# EAGLE design carte_balise_v100 (EAGLE 7.3.0)
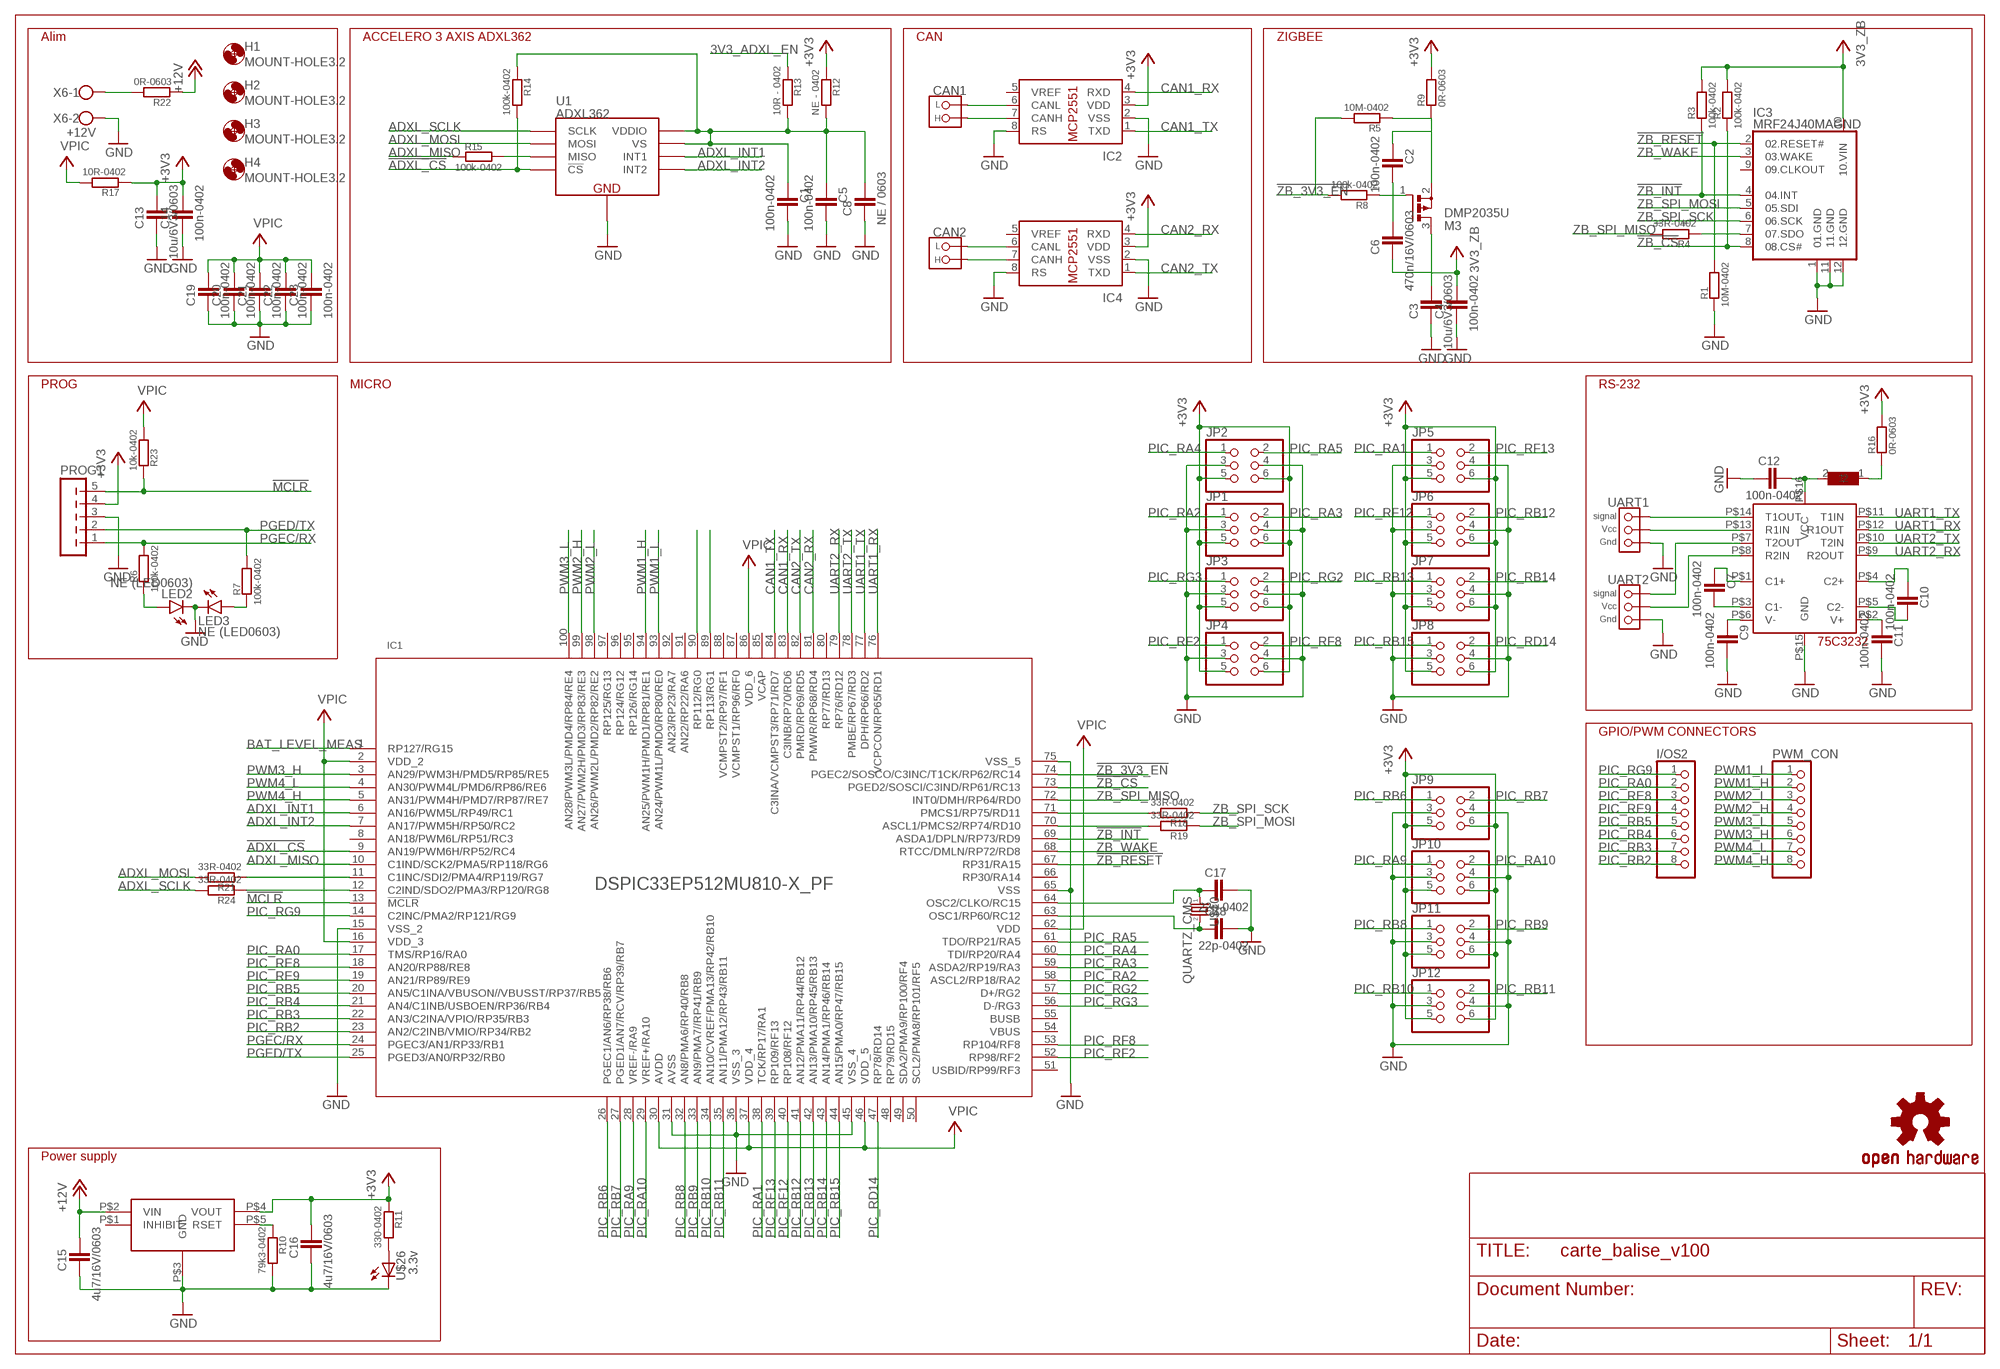
[diagram p0: schematic, sheet 1]

## Parts
C1  100n-0402  C0402K  [0402K]
C2  100n-0402  C0402K  [0402K]
C3  10u/6V3/0603  C0603K  [0603K]
C4  100n-0402  C0402K  [0402K]
C5  100n-0402  C0402K  [0402K]
C6  470n/16V/0603  C0603K  [0603K]
C7  100n-0402  C0402K  [0402K]
C8  NE / 0603  C0603K  [0603K]
C9  100n-0402  C0402K  [0402K]
C10  100n-0402  C0402K  [0402K]
C11  100n-0402  C0402K  [0402K]
C12  100n-0402  C0402K  [0402K]
C13  10u/6V3/0603  C0603K  [0603K]
C14  100n-0402  C0402K  [0402K]
C15  4u7/16V/0603  C0603K  [0603K]
C16  4u7/16V/0603  C0603K  [0603K]
C17  22p-0402  C0402K  [0402K]
C18  22p-0402  C0402K  [0402K]
C19  100n-0402  C0402K  [0402K]
C20  100n-0402  C0402K  [0402K]
C21  100n-0402  C0402K  [0402K]
C22  100n-0402  C0402K  [0402K]
C23  100n-0402  C0402K  [0402K]
CAN1  CONNECT_CAN  [CONNECT_CAN]
CAN2  CONNECT_CAN  [CONNECT_CAN]
H1  MOUNT-HOLE3.2  [3,2]
H2  MOUNT-HOLE3.2  [3,2]
H3  MOUNT-HOLE3.2  [3,2]
H4  MOUNT-HOLE3.2  [3,2]
I/OS2  PINHD-1X08_2.54  [1X08]
IC1  DSPIC33EP512MU810-X_PF  [TQFP100_14X14MC]
IC2  MCP2551/SN  [SO08]
IC3  MRF24J40MAGND  [MRF24J40MA_2]
IC4  MCP2551/SN  [SO08]
JP1  PINHD-2X3  [2X03]
JP2  PINHD-2X3  [2X03]
JP3  PINHD-2X3  [2X03]
JP4  PINHD-2X3  [2X03]
JP5  PINHD-2X3  [2X03]
JP6  PINHD-2X3  [2X03]
JP7  PINHD-2X3  [2X03]
JP8  PINHD-2X3  [2X03]
JP9  PINHD-2X3  [2X03]
JP10  PINHD-2X3  [2X03]
JP11  PINHD-2X3  [2X03]
JP12  PINHD-2X3  [2X03]
LED2  NE (LED0603)  LED0603K  [0603K]
LED3  NE (LED0603)  LED0603K  [0603K]
M3  DMP2035U  [SOT23-3]
PROG1  FE05-1  [FE05-1]
PWM_CON  PINHD-1X08_2.54  [1X08]
R1  10M-0402  R0402K  [0402K]
R2  100k-0402  R0402K  [0402K]
R3  100k-0402  R0402K  [0402K]
R4  33R-0402  R0402K  [0402K]
R5  10M-0402  R0402K  [0402K]
R6  100k-0402  R0402K  [0402K]
R7  100k-0402  R0402K  [0402K]
R8  100k-0402  R0402K  [0402K]
R9  0R-0603  R0603K  [0603K]
R10  79k3-0402  R0402K  [0402K]
R11  330-0402  R0402K  [0402K]
R12  NE - 0402  R0402K  [0402K]
R13  10R - 0402  R0402K  [0402K]
R14  100k-0402  R0402K  [0402K]
R15  100k-0402  R0402K  [0402K]
R16  0R-0603  R0603K  [0603K]
R17  10R-0402  R0402K  [0402K]
R18  33R-0402  R0402K  [0402K]
R19  33R-0402  R0402K  [0402K]
R21  33R-0402  R0402K  [0402K]
R22  0R-0603  R0603K  [0603K]
R23  10k-0402  R0402K  [0402K]
R24  33R-0402  R0402K  [0402K]
U1  ADXL362  [ADXL362]
U$1  OSHW-LOGOS  [OSHW-LOGO-S]
U$2  SN75C3232_PW  [PW16]
U$3  L_603  [0603]
U$10  QUARTZ_CMS  [QUARTZ_CMS]
U$26  3.3v  LED_805  [805]
U$27  PTR08100W  [PTR08100W]
UART1  CONNECT_3PINS_CMS  [CON_2.54_3]
UART2  CONNECT_3PINS_CMS  [CON_2.54_3]
X6  +12V  W237-102  [W237-102]

## Nets
3V3_ADXL_EN: R13.1
!ADXL_CS: IC1.9(AN19/PWM6H/RP52/RC4) R14.2 U1.P$8(!CS)
!MCLR: IC1.13(!MCLR) PROG1.5 R23.1
!ZB_3V3_EN: IC1.74(PGEC2/SOSCO/C3INC/T1CK/RP62/RC14) R5.2 R8.2
!ZB_CS: IC1.73(PGED2/SOSCI/C3IND/RP61/RC13) IC3.8(08.CS#) R2.1
!ZB_INT: IC1.69(ASDA1/DPLN/RP73/RD9) IC3.4(04.INT) R3.1
!ZB_RESET: IC1.67(RP31/RA15) IC3.2(02.RESET#) R1.2
+3V3: C13.1 C14.1 C16.1 IC2.3(VDD) IC4.3(VDD) JP1.5 JP1.6 JP2.5 JP2.6 JP3.5 JP3.6 JP4.5 JP4.6 JP5.5 JP5.6 JP6.5 JP6.6 JP7.5 JP7.6 JP8.5 JP8.6 JP9.5 JP9.6 JP10.5 JP10.6 JP11.5 JP11.6 JP12.5 JP12.6 PROG1.4 R9.2 R11.1 R12.1 R16.2 R17.1 U$27.P$4(VOUT)
+12V: C15.1 R22.1 U$27.P$2(VIN)
ADXL_INT1: IC1.6(AN16/PWM5L/RP49/RC1) U1.P$11(INT1)
ADXL_INT2: IC1.7(AN17/PWM5H/RP50/RC2) U1.P$9(INT2)
ADXL_MISO: IC1.10(C1IND/SCK2/PMA5/RP118/RG6) R15.1
ADXL_MOSI: R21.2 U1.P$6(MOSI)
ADXL_SCLK: R24.2 U1.P$4(SCLK)
BAT_LEVEL_MEAS: IC1.1(RP127/RG15)
CAN1_RX: IC1.83(C3INB/RP70/RD6) IC2.4(RXD)
CAN1_TX: IC1.84(C3INA/VCMPST3/RP71/RD7) IC2.1(TXD)
CAN2_RX: IC1.81(PMWR/RP68/RD4) IC4.4(RXD)
CAN2_TX: IC1.82(PMRD/RP69/RD5) IC4.1(TXD)
GND: C1.1 C3.2 C4.2 C5.1 C8.2 C9.1 C11.1 C12.2 C13.2 C14.2 C15.2 C16.2 C17.1 C18.1 C19.2 C20.2 C21.2 C22.2 C23.2 IC1.15(VSS_2) IC1.31(AVSS) IC1.36(VSS_3) IC1.45(VSS_4) IC1.65(VSS) IC1.75(VSS_5) IC2.2(VSS) IC2.8(RS) IC3.1(01.GND) IC3.11(11.GND) IC3.12(12.GND) IC4.2(VSS) IC4.8(RS) JP1.3 JP1.4 JP2.3 JP2.4 JP3.3 JP3.4 JP4.3 JP4.4 JP5.3 JP5.4 JP6.3 JP6.4 JP7.3 JP7.4 JP8.3 JP8.4 JP9.3 JP9.4 JP10.3 JP10.4 JP11.3 JP11.4 JP12.3 JP12.4 LED2.K(C) LED3.K(C) PROG1.3 R1.1 R10.2 U1.P$12(GND) U1.P$13(GND) U1.P$16(GND) U$2.P$15(GND) U$26.2(K) U$27.P$3(GND) UART1.P$1(_GND) UART2.P$1(_GND) X6.2
N$1: C2.1 C6.1 M3.1(G) R8.1
N$2: C2.2 M3.2(S) R5.1 R9.1
N$3: U$2.P$14(T1OUT) UART1.P$3(_SIGN)
N$4: C1.2 C5.2 C8.1 R12.2 R13.2 R14.1 U1.P$1(VDDIO) U1.P$14(VS)
N$5: R15.2 U1.P$7(MISO)
N$6: U$2.P$13(R1IN) UART1.P$2(_VCC)
N$7: IC3.7(07.SDO) R4.1
N$8: CAN2._L IC4.6(CANL)
N$9: C7.2 U$2.P$1(C1+)
N$10: IC1.12(C2IND/SDO2/PMA3/RP120/RG8) R24.1
N$11: LED2.A R6.1
N$12: C9.2 U$2.P$6(V-)
N$13: LED3.A R7.1
N$14: C7.1 U$2.P$3(C1-)
N$15: C11.2 U$2.P$2(V+)
N$16: C10.1 U$2.P$5(C2-)
N$17: C10.2 U$2.P$4(C2+)
N$18: C12.1 U$2.P$16(VCC) U$3.2
N$19: R16.1 U$3.1
N$20: CAN1._L IC2.6(CANL)
N$21: CAN1._H IC2.7(CANH)
N$22: CAN2._H IC4.7(CANH)
N$23: R11.2 U$26.1(A)
N$24: IC1.90(RP112/RG0)
N$25: IC1.89(RP113/RG1)
N$26: IC1.71(PMCS1/RP75/RD11) R18.2
N$27: U$2.P$7(T2OUT) UART2.P$3(_SIGN)
N$28: U$2.P$8(R2IN) UART2.P$2(_VCC)
N$29: C18.2 IC1.63(OSC1/RP60/RC12) U$10.P$2
N$30: C17.2 IC1.64(OSC2/CLKO/RC15) U$10.P$1
N$31: R22.2 X6.1
N$38: IC1.11(C1INC/SDI2/PMA4/RP119/RG7) R21.1
N$44: IC1.70(ASCL1/PMCS2/RP74/RD10) R19.2
N$63: R10.1 U$27.P$5(RSET)
PGEC/RX: IC1.24(PGEC3/AN1/RP33/RB1) PROG1.1 R6.2
PGED/TX: IC1.25(PGED3/AN0/RP32/RB0) PROG1.2 R7.2
PIC_RA0: I/OS2.2 IC1.17(TMS/RP16/RA0)
PIC_RA1: IC1.38(TCK/RP17/RA1) JP5.1
PIC_RA2: IC1.58(ASCL2/RP18/RA2) JP1.1
PIC_RA3: IC1.59(ASDA2/RP19/RA3) JP1.2
PIC_RA4: IC1.60(TDI/RP20/RA4) JP2.1
PIC_RA5: IC1.61(TDO/RP21/RA5) JP2.2
PIC_RA9: IC1.28(VREF-/RA9) JP10.1
PIC_RA10: IC1.29(VREF+/RA10) JP10.2
PIC_RB2: I/OS2.8 IC1.23(AN2/C2INB/VMIO/RP34/RB2)
PIC_RB3: I/OS2.7 IC1.22(AN3/C2INA/VPIO/RP35/RB3)
PIC_RB4: I/OS2.6 IC1.21(AN4/C1INB/USBOEN/RP36/RB4)
PIC_RB5: I/OS2.5 IC1.20(AN5/C1INA/VBUSON//VBUSST/RP37/RB5)
PIC_RB6: IC1.26(PGEC1/AN6/RP38/RB6) JP9.1
PIC_RB7: IC1.27(PGED1/AN7/RCV/RP39/RB7) JP9.2
PIC_RB8: IC1.32(AN8/PMA6/RP40/RB8) JP11.1
PIC_RB9: IC1.33(AN9/PMA7//RP41/RB9) JP11.2
PIC_RB10: IC1.34(AN10/CVREF/PMA13/RP42/RB10) JP12.1
PIC_RB11: IC1.35(AN11/PMA12/RP43/RB11) JP12.2
PIC_RB12: IC1.41(AN12/PMA11/RP44/RB12) JP6.2
PIC_RB13: IC1.42(AN13/PMA10/RP45/RB13) JP7.1
PIC_RB14: IC1.43(AN14/PMA1/RP46/RB14) JP7.2
PIC_RB15: IC1.44(AN15/PMA0/RP47/RB15) JP8.1
PIC_RD14: IC1.47(RP78/RD14) JP8.2
PIC_RE8: I/OS2.3 IC1.18(AN20/RP88/RE8)
PIC_RE9: I/OS2.4 IC1.19(AN21/RP89/RE9)
PIC_RF2: IC1.52(RP98/RF2) JP4.1
PIC_RF8: IC1.53(RP104/RF8) JP4.2
PIC_RF12: IC1.40(RP108/RF12) JP6.1
PIC_RF13: IC1.39(RP109/RF13) JP5.2
PIC_RG2: IC1.57(D+/RG2) JP3.2
PIC_RG3: IC1.56(D-/RG3) JP3.1
PIC_RG9: I/OS2.1 IC1.14(C2INC/PMA2/RP121/RG9)
PWM1_H: IC1.94(AN25/PWM1H/PMD1/RP81/RE1) PWM_CON.2
PWM1_L: IC1.93(AN24/PWM1L/PMD0/RP80/RE0) PWM_CON.1
PWM2_H: IC1.99(AN27/PWM2H/PMD3/RP83/RE3) PWM_CON.4
PWM2_L: IC1.98(AN26/PWM2L/PMD2/RP82/RE2) PWM_CON.3
PWM3_H: IC1.3(AN29/PWM3H/PMD5/RP85/RE5) PWM_CON.6
PWM3_L: IC1.100(AN28/PWM3L/PMD4/RP84/RE4) PWM_CON.5
PWM4_H: IC1.5(AN31/PWM4H/PMD7/RP87/RE7) PWM_CON.8
PWM4_L: IC1.4(AN30/PWM4L/PMD6/RP86/RE6) PWM_CON.7
UART1_RX: IC1.76(VCPCON/RP65/RD1) U$2.P$12(R1OUT)
UART1_TX: IC1.77(DPH/RP66/RD2) U$2.P$11(T1IN)
UART2_RX: IC1.79(RP76/RD12) U$2.P$9(R2OUT)
UART2_TX: IC1.78(PMBE/RP67/RD3) U$2.P$10(T2IN)
V+: C19.1 C20.1 C21.1 C22.1 C23.1 IC1.2(VDD_2) IC1.16(VDD_3) IC1.30(AVDD) IC1.37(VDD_4) IC1.46(VDD_5) IC1.62(VDD) IC1.86(VDD_6) R17.2 ; supply symbol labelled VPIC
VDD_RADIO: C3.1 C4.1 C6.2 IC3.10(10.VIN) M3.3(D) R2.2 R3.2 ; supply symbol labelled 3V3_ZB
VPIC: R23.2
ZB_SPI_MISO: IC1.72(INT0/DMH/RP64/RD0) R4.2
ZB_SPI_MOSI: IC3.5(05.SDI) R19.1
ZB_SPI_SCK: IC3.6(06.SCK) R18.1
ZB_WAKE: IC1.68(RTCC/DMLN/RP72/RD8) IC3.3(03.WAKE)
Unconnected: IC1.8(AN18/PWM6L/RP51/RC3) IC1.48(RP79/RD15) IC1.49(SDA2/PMA9/RP100/RF4) IC1.50(SCL2/PMA8/RP101/RF5) IC1.51(USBID/RP99/RF3) IC1.66(RP30/RA14) IC1.80(RP77/RD13) IC1.87(VCMPST1/RP96/RF0) IC1.88(VCMPST2/RP97/RF1) IC1.91(AN22/RP22/RA6) IC1.92(AN23/RP23/RA7) IC1.95(RP126/RG14) IC1.96(RP124/RG12) IC1.97(RP125/RG13) IC2.5(VREF) IC3.9(09.CLKOUT) IC4.5(VREF) U$27.P$1(INHIBIT)

## Notes on the sheet
- Alim | ACCELERO 3 AXIS ADXL362 | CAN | ZIGBEE
- PROG | MICRO | RS-232
- GPIO/PWM CONNECTORS
- Power supply

## Power pins joined to a net without a drawn wire
BUSB: IC1.55(BUSB)
VBUS: IC1.54(VBUS)
VCAP: IC1.85(VCAP)

## Library data of the parts
C1-C23 = DEVIALET_CAPACITORS:C: SMD capacitor
CAN1 CAN2 = clubrobot2:CONNECT_CAN: Connecteur CAN (club robot) Utilisé pour relier le cable de liaison CAN. Mais peut également être utilisé comme un connecteur à 2 broches (le pas est standard) pour des capteurs par exemple.
H1-H4 = holes:MOUNT-HOLE: MOUNTING HOLE with drill center marker
I/OS2 PWM_CON = pinhead-2:PINHD-1X08: PIN HEADER
IC1 = dspic33ep:DSPIC33EP512MU810-X_PF: dsPIC33EP512MU810-X_PF TQFP100 14x14
IC2 IC4 = microchip-dspic:MCP2551: High-Speed CAN Transceiver
IC3 = DEVIALET_MICROCHIP:MRF24J40MA: 2.4 GHz IEEE Std. 802.15.4 RF Transceiver Module
JP1-JP12 = pinhead:PINHD-2X3: PIN HEADER
LED2 LED3 = DEVIALET_LEDS:LED: SMD led
M3 = DEVIALET_TRANSISTORS:DMP2035: P-CHANNEL ENHANCEMENT MODE MOSFET
PROG1 = clubrobot:FE05-1: FEMALE HEADER
R1-R19 R21-R24 = DEVIALET_RESISTORS:R: SMD resistor
U1 = SparkFun-Sensors:ADXL362: Micropower 3-axis accelerometer 2/4/8g digital output (SPI)
U$1 = SparkFun-Aesthetics:OSHW-LOGO: Open Source Hardware Logo This logo indicates the piece of hardware it is found on incorporates a OSHW license and/or adheres to the definition of open source hardware found here: http://freedomdefined.org/OSHW
U$2 = etienne:SN75C3232
U$3 = etienne:L
U$10 = etienne:QUARTZ: Quartz (club robot)
U$26 = etienne:LED
U$27 = etienne:PTR08100W
UART1 UART2 = etienne:CONNECT_3PINS: Connecteur à 3 broches (club robot) Utilisé principalement pour les capteurs ou les servomoteurs.
X6 = con-wago-500:W237-102: WAGO SCREW CLAMP

## Board
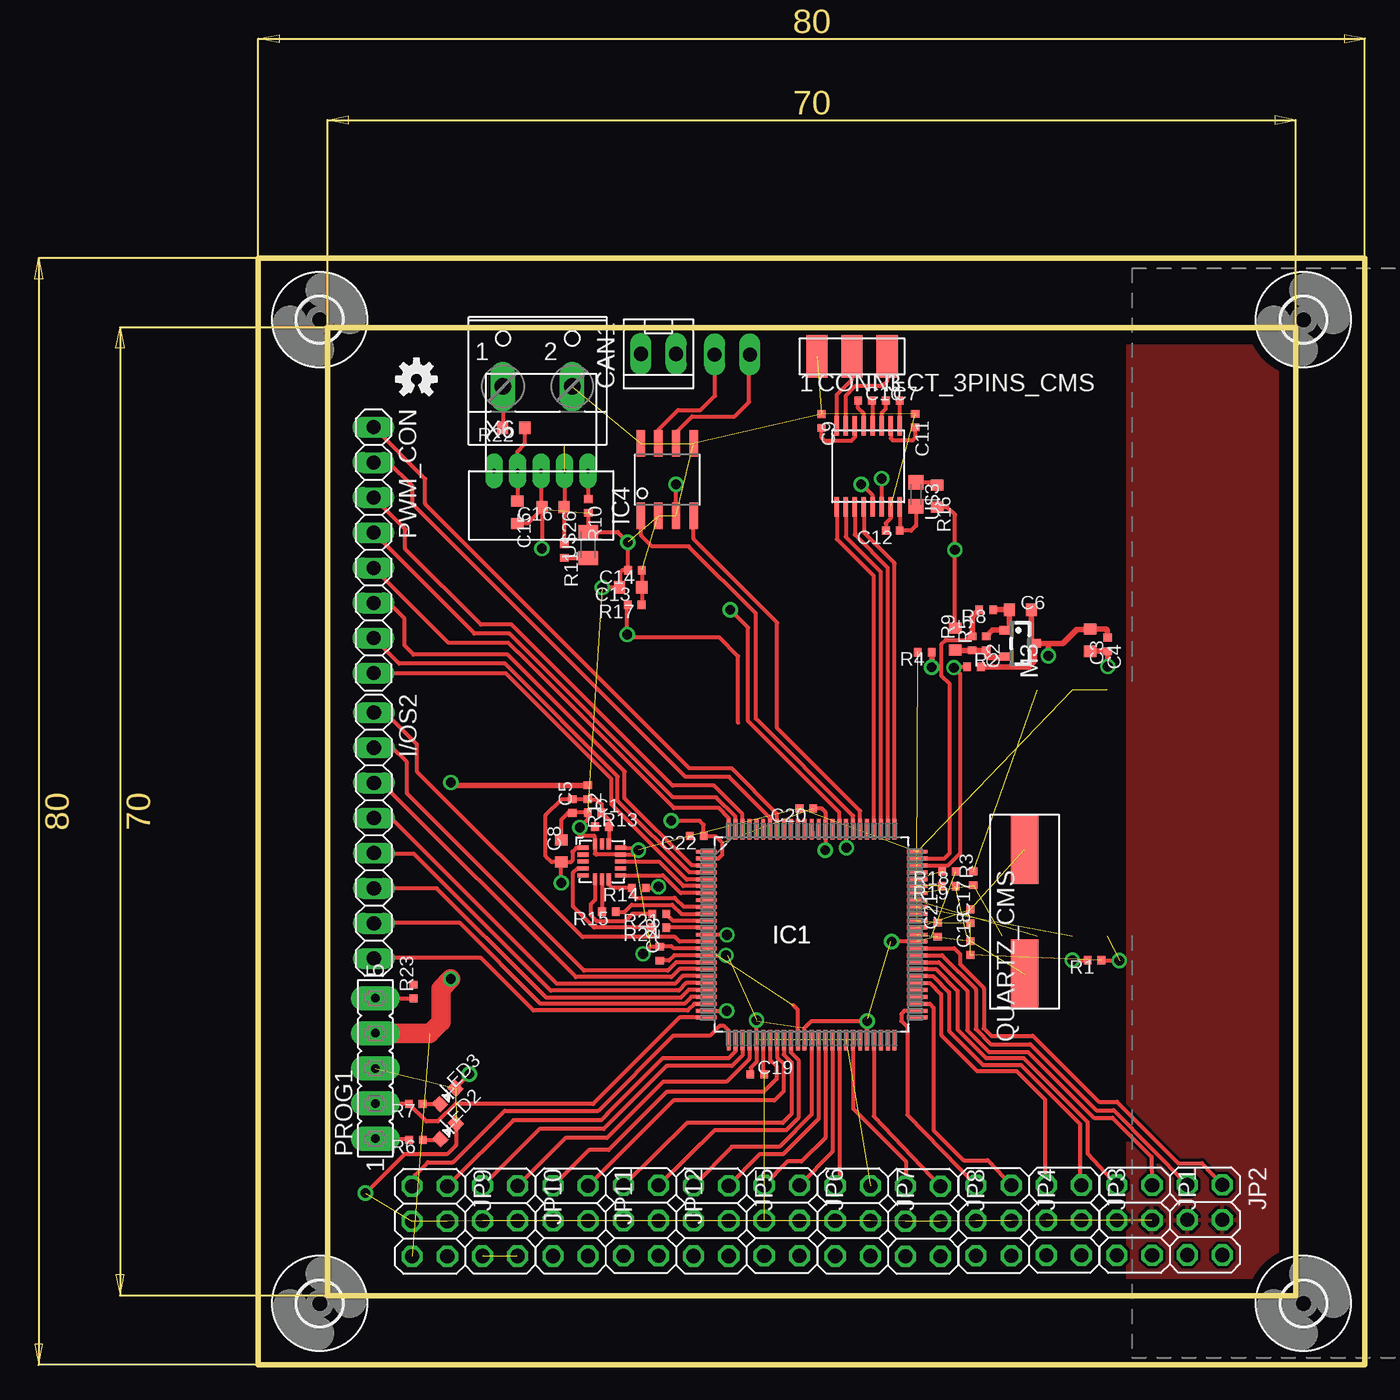
[diagram p1: board, top side]
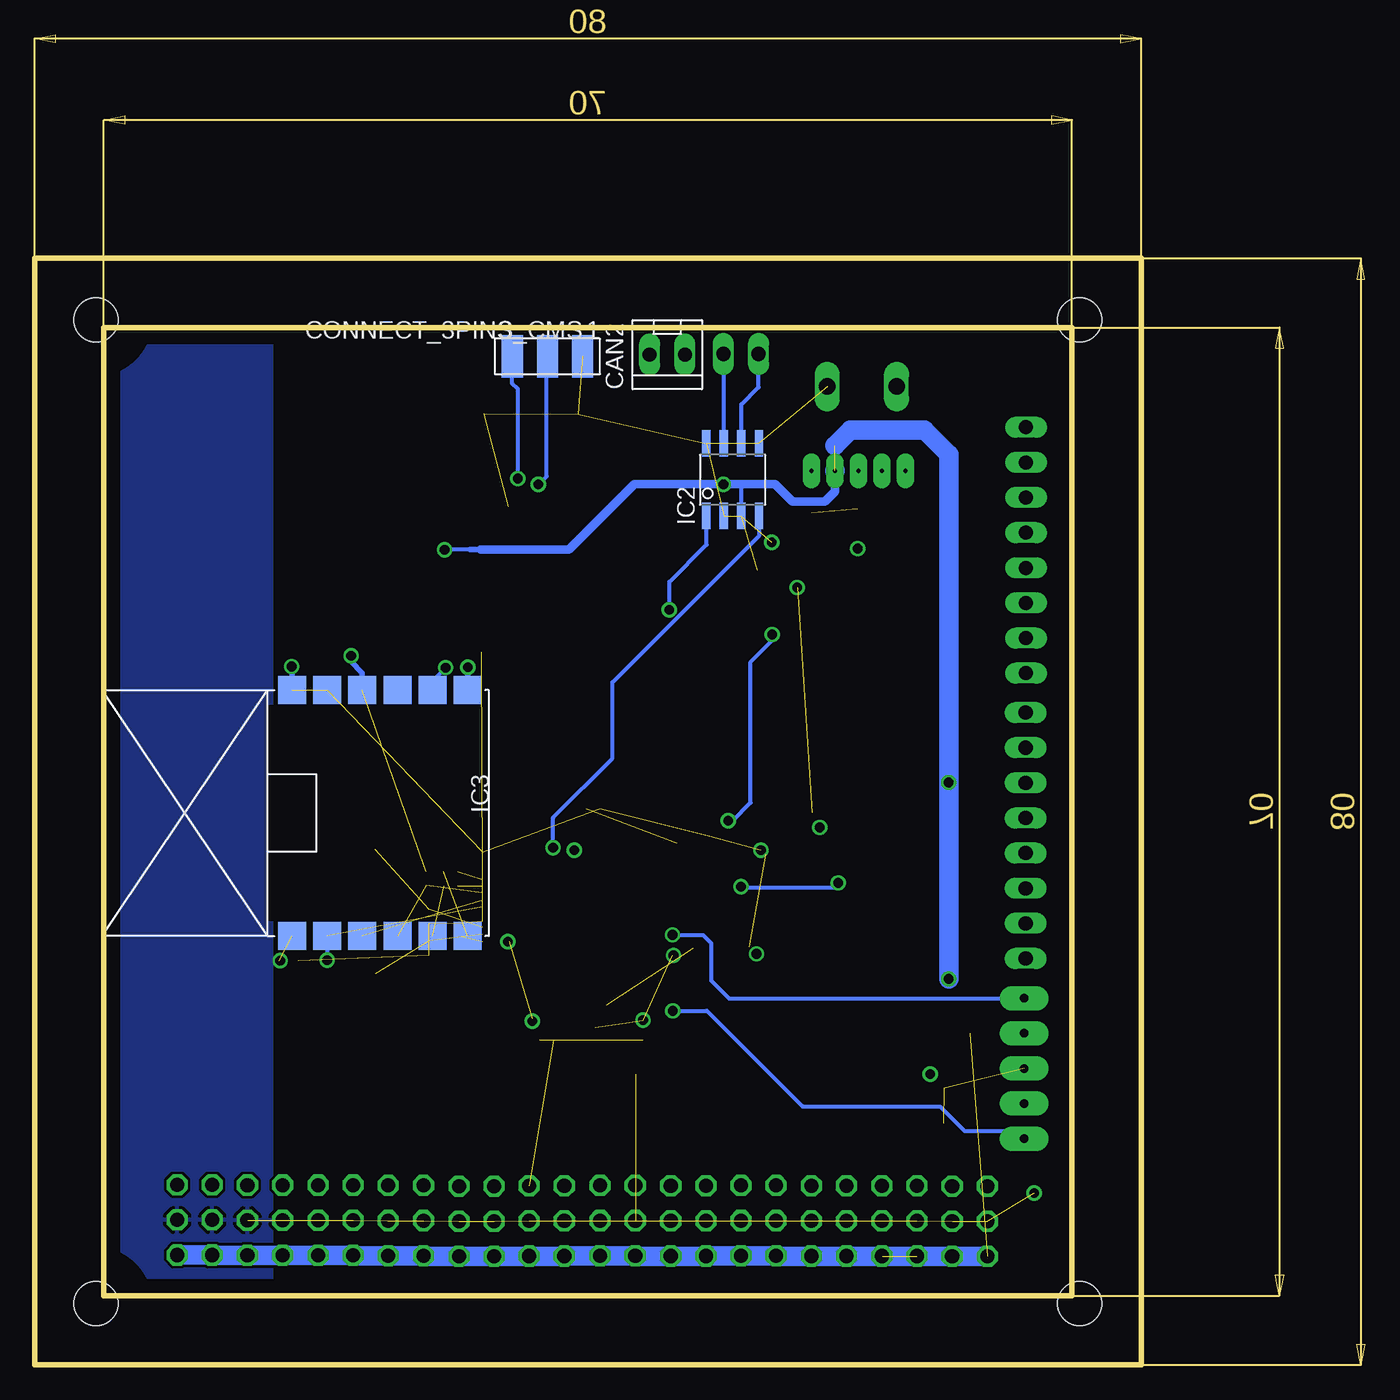
[diagram p2: board, bottom side, seen from below]

Size 80 x 80 mm. Coordinates in mm from the lower left corner, seen from the top.
Outline: 75,5 5,5 5,75 75,75 75,5
Outline: 0,0 80,0 80,80 0,80 0,0
Copper layers (1*16): Top 0.035mm / dielectric 1.5mm / Bottom 0.035mm
Design rules "default": minimum track width 10mil, minimum drill 24mil, track to track 8mil, track to pad 8mil, pad to pad 8mil, via to via 8mil, smd to smd 8mil, copper to edge 40mil, drill to drill 8mil, minimum pad ring 10mil, minimum via ring 8mil, stop-mask expansion 4mil, vias tented up to drill 0mil, thermal gap 10mil

### Footprints (pad centres in the part's own frame; a part is rotated, then mirrored left to right if it is on the bottom)
0402K = smd 0.55 x 0.6: 1 -0.5,0; 2 0.5,0
0603K = smd 0.8 x 0.9: 1 -0.8,0; 2 0.8,0
CONNECT_CAN = drill 1.016 long: _H 0,-1.27; _L 0,1.27
3,2 = hole 3.2: 0,0
1X08 = drill 1.016 long: 1 -8.89,0; 2 -6.35,0; 3 -3.81,0; 4 -1.27,0; 5 1.27,0; 6 3.81,0; 7 6.35,0; 8 8.89,0
TQFP100_14X14MC = smd 1.473 x 0.279: 1 -7.62,5.994; 2 -7.62,5.512; 3 -7.62,5.004; 4 -7.62,4.496; 5 -7.62,3.988; 6 -7.62,3.505; 7 -7.62,2.997; 8 -7.62,2.489; 9 -7.62,2.007; 10 -7.62,1.499; 11 -7.62,0.991; 12 -7.62,0.508; 13 -7.62,0; 14 -7.62,-0.508; 15 -7.62,-0.991; 16 -7.62,-1.499; 17 -7.62,-2.007; 18 -7.62,-2.489; 19 -7.62,-2.997; 20 -7.62,-3.505; 21 -7.62,-3.988; 22 -7.62,-4.496; 23 -7.62,-5.004; 24 -7.62,-5.512; 25 -7.62,-5.994; 51 7.62,-5.994; 52 7.62,-5.512; 53 7.62,-5.004; 54 7.62,-4.496; 55 7.62,-3.988; 56 7.62,-3.505; 57 7.62,-2.997; 58 7.62,-2.489; 59 7.62,-2.007; 60 7.62,-1.499; 61 7.62,-0.991; 62 7.62,-0.508; 63 7.62,0; 64 7.62,0.508; 65 7.62,0.991; 66 7.62,1.499; 67 7.62,2.007; 68 7.62,2.489; 69 7.62,2.997; 70 7.62,3.505; 71 7.62,3.988; 72 7.62,4.496; 73 7.62,5.004; 74 7.62,5.512; 75 7.62,5.994 | smd 0.279 x 1.473: 26 -5.994,-7.62; 27 -5.512,-7.62; 28 -5.004,-7.62; 29 -4.496,-7.62; 30 -3.988,-7.62; 31 -3.505,-7.62; 32 -2.997,-7.62; 33 -2.489,-7.62; 34 -2.007,-7.62; 35 -1.499,-7.62; 36 -0.991,-7.62; 37 -0.508,-7.62; 38 0,-7.62; 39 0.508,-7.62; 40 0.991,-7.62; 41 1.499,-7.62; 42 2.007,-7.62; 43 2.489,-7.62; 44 2.997,-7.62; 45 3.505,-7.62; 46 3.988,-7.62; 47 4.496,-7.62; 48 5.004,-7.62; 49 5.512,-7.62; 50 5.994,-7.62; 76 5.994,7.62; 77 5.512,7.62; 78 5.004,7.62; 79 4.496,7.62; 80 3.988,7.62; 81 3.505,7.62; 82 2.997,7.62; 83 2.489,7.62; 84 2.007,7.62; 85 1.499,7.62; 86 0.991,7.62; 87 0.508,7.62; 88 0,7.62; 89 -0.508,7.62; 90 -0.991,7.62; 91 -1.499,7.62; 92 -2.007,7.62; 93 -2.489,7.62; 94 -2.997,7.62; 95 -3.505,7.62; 96 -3.988,7.62; 97 -4.496,7.62; 98 -5.004,7.62; 99 -5.512,7.62; 100 -5.994,7.62
SO08 = smd 0.61 x 1.905: 1 -1.905,-2.616; 2 -0.635,-2.616; 3 0.635,-2.616; 4 1.905,-2.616; 5 1.905,2.616; 6 0.635,2.616; 7 -0.635,2.616; 8 -1.905,2.616
MRF24J40MA_2 = smd 2.032 x 2.032: 1 -8.89,14.224; 2 -8.89,11.684; 3 -8.89,9.144; 4 -8.89,6.604; 5 -8.89,4.064; 6 -8.89,1.524; 7 8.89,1.524; 8 8.89,4.064; 9 8.89,6.604; 10 8.89,9.144; 11 8.89,11.684; 12 8.89,14.224
2X03 = drill 1.016 octagon: 1 -2.54,-1.27; 2 -2.54,1.27; 3 0,-1.27; 4 0,1.27; 5 2.54,-1.27; 6 2.54,1.27
0603K' = smd 0.8 x 0.9: A -0.8,0; K 0.8,0
SOT23-3 = smd 0.6 x 1: 1 -0.95,-1; 2 0.95,-1; 3 0,1
FE05-1 = drill 0.61 pad 1.778 long: 1 -5.08,0; 2 -2.54,0; 3 0,0; 4 2.54,0; 5 5.08,0
ADXL362 = smd 0.8 x 0.3: P$1 -1.35,1; P$2 -1.35,0.5; P$3 -1.35,0; P$4 -1.35,-0.5; P$5 -1.35,-1; P$9 1.35,-1; P$10 1.35,-0.5; P$11 1.35,0; P$12 1.35,0.5; P$13 1.35,1 | smd 0.3 x 0.8: P$6 -0.5,-1.275; P$7 0,-1.275; P$8 0.5,-1.275; P$14 0.5,1.275; P$15 0,1.275; P$16 -0.5,1.275
PW16 = smd 0.35 x 1.4: P$1 -2.275,-2.925; P$2 -1.625,-2.925; P$3 -0.975,-2.925; P$4 -0.325,-2.925; P$5 0.325,-2.925; P$6 0.975,-2.925; P$7 1.625,-2.925; P$8 2.275,-2.925; P$9 2.275,2.925; P$10 1.625,2.925; P$11 0.975,2.925; P$12 0.325,2.925; P$13 -0.325,2.925; P$14 -0.975,2.925; P$15 -1.625,2.925; P$16 -2.275,2.925
0603 = smd 1.05 x 1.08: 1 -0.875,0; 2 0.875,0
QUARTZ_CMS = smd 5 x 2: P$1 -4.5,0; P$2 4.5,0
805 = smd 1 x 1.4: 1 -0.95,0; 2 0.95,0
PTR08100W = drill 0.305 pad 1.27 long: P$1 3.4,0; P$2 1.7,0; P$3 0,0; P$4 -1.7,0; P$5 -3.4,0
CON_2.54_3 = smd 3.048 x 1.524: P$1 0,-2.54; P$2 0,0; P$3 0,2.54
W237-102 = drill 1.194 long: 1 -2.5,-1.27; 2 2.5,-1.27

### Placement (x,y rotation side)
C1  24.3,39.92 0 top
C2  52.62,52.17 270 top
C3  60.12,52.4 270 top
C4  61.39,52.09 270 top
C5  22.7,40.41 90 top
C6  55.09,54.61 0 top
C7  45.87,69.72 0 top
C8  21.89,37.16 90 top
C9  40.71,68.24 270 top
C10  43.86,69.72 0 top
C11  47.49,68.27 270 top
C12  45.87,60.32 180 top
C13  26.92,56.21 180 top
C14  27.22,57.45 180 top
C15  18.71,61.64 270 top
C16  21.31,62.02 180 top
C17  51.48,32.43 90 top
C18  51.48,30.14 90 top
C19  36.06,21 0 top
C20  39.62,40.23 180 top
C21  49.12,31.47 90 top
C22  31.69,38.25 180 top
C23  29.03,29.74 90 top
CAN1  28.93,73.1 90 top
CAN2  34.26,73.05 90 bottom
H1  75.56,4.44 0 top
H2  4.44,75.56 0 top
H3  75.56,75.56 0 top
H4  4.44,4.44 0 top
I/OS2  8.35,38.27 270 top
IC1  40,31.11 0 top
IC2  29.54,64 0 bottom
IC3  47.16,39.9 90 bottom
IC4  29.56,64 0 top
JP1  63.34,10.46 270 top
JP2  68.42,10.49 270 top
JP3  58.24,10.46 270 top
JP4  53.16,10.43 270 top
JP5  32.74,10.41 270 top
JP6  37.84,10.43 270 top
JP7  42.97,10.41 270 top
JP8  48.05,10.38 270 top
JP9  12.39,10.38 270 top
JP10  17.47,10.41 270 top
JP11  22.58,10.41 270 top
JP12  27.66,10.43 270 top
LED2  NE (LED0603)  [0603K']  13.71,16.89 45 top
LED3  NE (LED0603)  [0603K']  13.69,19.43 45 top
M3  55.09,52.17 270 top
PROG1  8.45,21.43 90 top
PWM_CON  8.33,58.9 270 top
R1  60.45,29.26 180 top
R2  51.73,50.46 0 top
R3  51.68,35.17 90 top
R4  48.18,51.53 180 top
R5  51.61,52.17 90 top
R6  11.4,16.28 180 top
R7  11.37,18.87 180 top
R8  52.62,54.61 180 top
R9  50.36,52.47 90 top
R10  23.85,62.1 270 top
R11  22.12,58.85 270 top
R12  23.82,41.4 270 top
R13  24.84,38.91 0 top
R14  27.5,34.49 180 top
R15  25.34,32.76 180 top
R16  49.07,62.81 270 top
R17  27.2,54.96 180 top
R18  49.93,35.68 180 top
R19  49.91,34.62 180 top
R21  28.98,32.61 180 top
R22  18.46,67.74 180 top
R23  11.22,27 90 top
R24  28.98,31.62 180 top
U1  24.84,36.39 0 top
U$1  11.43,71.27 0 top
U$2  44.09,64.97 180 top
U$3  47.54,62.94 270 top
U$10  55.39,32.76 270 top
U$26  23.85,59.28 90 top
U$27  20.44,64.64 180 top
UART1  42.92,72.92 90 bottom
UART2  42.92,72.92 270 top
X6  20.19,72 0 top

### Tracks (layer width: path | path; a pad name or v marks a point on that pad's centre or on a via)
!ADXL_CS
  Top 0.305: U1.P$8 25.34,34.73 25.52,34.54 26.95,34.54 R14.2 27,34.02 27.25,33.78 30.09,33.78 30.75,33.12 IC1.9
!MCLR  (via drill 0.7 pad 0.61)
  Top 0.305: PROG1.5 11.2,26.51 R23.1 | IC1.13 33.85,31.11 v33.88,31.09
  Bottom 0.305: v33.88,31.09 31.67,31.09 31.09,30.5 31.09,27.78 29.79,26.49 8.48,26.49 PROG1.5
!ZB_3V3_EN
  Top 0.305: IC1.74 49.6,36.62 49.98,37 49.98,49.22 49.4,49.8 49.4,52.12 49.7,52.42 51.36,52.42 R5.2
  Top 0.406: R8.2 51.63,54.12 51.63,52.69 R5.2 51.5,52.67 51.28,52.45
!ZB_CS  (via drill 0.7 pad 0.61)
  Top 0.305: IC1.73 49.86,36.11 50.74,37 50.74,49.96 v50.29,50.41 50.34,50.47 R2.1
  Bottom 0.305: v50.29,50.41 50.29,50.36 50.92,49.73 50.92,49.09 IC3.8
!ZB_INT  (2 unrouted)
!ZB_RESET  (via drill 0.7 pad 0.61)  (1 unrouted)
  Top 0.305: v58.85,29.26 R1.2
  Bottom 0.305: IC3.2 v58.85,29.26
+3V3  (via drill 0.7 pad 0.61)  (4 unrouted)
  Top 0.305: U$27.P$4 22.14,62.06 C16.1 22.11,59.36 R11.1 | R9.2 v50.36,58.92 50.36,61.46 49.83,62 49.08,62 R16.2 | R17.1 27.72,54.98 C13.1 C14.1 | IC4.3 v30.2,63.67
  Top 0.406: R12.1 14.12,41.9 v13.91,42.11
  Top 1.422: PROG1.4 12.36,23.97 13.2,24.81 13.2,27.2 v13.91,27.91
  Bottom 0.305: 48.51,58.95 50.34,58.95 v50.36,58.92 | IC2.3 28.9,63.67
  Bottom 0.406: 47.77,58.95 48.51,58.95
  Bottom 0.61: 22.12,64.66 22.12,63.14 22.86,62.4 25.22,62.4 26.49,63.67 28.9,63.67 v30.2,63.67 36.62,63.67 41.35,58.95 47.77,58.95
  Bottom 1.422: v13.91,27.91 v13.91,42.11 13.91,65.83 15.67,67.58 21,67.58 22.12,66.47 | 22.12,64.66 U$27.P$4 | JP9.5 JP9.6 18.71,7.84 JP10.6 JP11.5 JP11.6 26.36,7.87 JP12.5 JP12.6 31.44,7.89 JP5.5 JP5.6 36.55,7.87 JP6.5 JP6.6 41.68,7.89 JP7.5 JP7.6 46.76,7.87 JP8.5 JP8.6 51.84,7.84 JP4.5 JP4.6 56.94,7.89 JP3.5 JP3.6 JP1.5 JP1.6 67.13,7.92 JP2.5 JP2.6
+12V
  Top 0.305: R22.1 19.26,66.56 18.71,66.01 18.71,64.66 U$27.P$2 18.74,62.47 C15.1
ADXL_INT1
  Top 0.305: IC1.6 30.73,34.62 28.95,36.39 U1.P$11
ADXL_INT2
  Top 0.305: IC1.7 30.53,34.11 29.24,35.39 U1.P$9
ADXL_MISO
  Top 0.305: R15.1 26.49,32.76 26.99,33.27 29.92,33.27 30.58,32.61 IC1.10
ADXL_MOSI
  Top 0.305: R21.2 27.05,32.61 26.51,32.08 24.48,32.08 24.05,32.51 24.05,33.32 24.34,33.61 U1.P$6
ADXL_SCLK
  Top 0.305: R24.2 24.28,31.62 22.73,33.17 22.73,35.55 23.07,35.89 U1.P$4
CAN1_RX  (via drill 0.7 pad 0.61)
  Top 0.305: IC1.83 42.49,37.41 v42.52,37.38
  Bottom 0.305: v42.52,37.38 42.52,39.57 38.22,43.86 38.22,49.35 27.61,59.96 27.61,61.36 IC2.4
CAN1_TX  (via drill 0.7 pad 0.61)
  Top 0.305: IC1.84 42.01,39.95 35.4,46.55 35.4,53.31 v34.11,54.61
  Bottom 0.305: v34.11,54.61 34.11,56.61 31.41,59.3 31.41,61.36 IC2.1
CAN2_RX
  Top 0.305: IC1.81 43.51,40.05 37.51,46.05 37.51,53.66 31.47,59.71 IC4.4
CAN2_TX
  Top 0.305: IC1.82 43,39.7 35.96,46.73 35.96,54.33 31.11,59.18 28.47,59.18 27.68,59.96 27.68,61.36 IC4.1
GND  (via drill 0.7 pad 0.61)  (52 unrouted)
  Top 0.305: U$27.P$3 20.44,62.09 C16.2 20.51,61.88 | 20.51,61.88 19.45,60.83 18.73,60.83 C15.2 | R10.2 U$26.2 25.97,60.23 v26.72,59.48 v26.72,59.47 C14.2 26.34,57.45 26.13,57.25 26.13,56.22 C13.2 v24.86,56.2 | IC1.36 39.01,25.67 38.68,26.01 | IC1.31 36.49,21.07 C19.2 | C8.2 21.89,39.42 22.38,39.91 C5.1 22.72,39.92 C1.1 23.8,39.42 v23.24,38.86 23.24,38.3 23.29,38.25 24.28,38.25 24.34,38.19 U1.P$16 | IC1.15 30.02,30.12 29.89,30.25 C23.2 28.33,30.24 v27.81,29.71 | U1.P$16 24.34,37.88 | U1.P$16 24.34,36.97 24.41,36.89 U1.P$12 27.16,36.89 v27.48,37.21 27.29,37.39 U1.P$13 | U$2.P$15 45.71,61.21 45.36,60.85 C12.2 | LED3.K 14.25,20.02 v15.26,21.03 | LED2.K 14.28,15.88 13.64,15.23 10.56,15.23 v7.74,12.42 | 20.51,61.88 20.51,59.04 v20.49,59.02 | R1.1 62.23,29.26 v62.25,29.23
  Top 0.406: C3.2 C4.2 61.41,51.59 v61.41,50.49
  Bottom 0.305: v23.24,38.86 23.26,38.86 | v27.81,29.71 27.61,29.71 27.55,29.66 | v27.48,37.21 27.48,37.23 27.32,37.28 | v15.26,21.03 15.29,21.03 15.39,21.13 | v7.74,12.42 7.72,12.42 7.62,12.31 | v24.86,56.2 24.76,56.2 | v20.49,59.02 20.49,58.95 20.47,58.92 | v26.72,59.48 26.72,59.33 | v62.25,29.23 62.28,29.23 62.3,29.2
  Bottom 0.406: v61.41,50.49 61.39,50.82 IC3.12
  pour Bottom: 62.86,80.64 106.04,80.64 106.04,-0.64 62.86,-0.64
  pour Top: 106.04,80.64 62.86,80.64 62.86,-0.64 106.04,-0.64
N$1
  Top 0.406: C2.1 53.07,53.12 M3.1 54.29,53.32 C6.1 R8.1
N$2
  Top 0.406: M3.2 54.02,51.15 52.78,51.15 52.62,51.3 C2.2 R5.1 R9.1
N$3  (via drill 0.7 pad 0.61)
  Top 0.305: U$2.P$14 45.06,64.07 v45.05,64.08
  Bottom 0.305: v45.05,64.08 45.05,70.56 45.46,70.96 UART1.P$3
N$4  (via drill 0.7 pad 0.61)
  Top 0.305: C8.1 | U1.P$1 22.99,37.39 22.7,37.1 22.7,36.47 22.58,36.34 21.9,36.34 C8.1 | C8.1 21.2,36.35 20.78,36.77 20.77,36.77 20.77,39.75 21.94,40.91 C5.2 R12.2 24.45,40.9 24.81,40.53 24.81,39.93 C1.2 25.34,39.39 R13.2 U1.P$14 | v21.89,34.84 C8.1 | R14.1 28.85,34.49 v28.93,34.56
  Bottom 0.305: v21.89,34.84 22.25,34.49 28.85,34.49 v28.93,34.56
N$5
  Top 0.305: 24.84,32.92 R15.2 U1.P$7
N$6  (via drill 0.7 pad 0.61)
  Top 0.305: U$2.P$13 44.41,62.84 v43.58,63.67
  Bottom 0.305: v43.58,63.67 43.53,63.67 42.97,64.23 42.97,72.87 UART1.P$2
N$7  (via drill 0.7 pad 0.61)
  Top 0.406: R4.1 48.68,50.32 v48.69,50.44
  Bottom 0.406: v48.69,50.44 IC3.7
N$8
  Top 0.305: IC4.6 30.2,67.41 31.36,68.58 34.44,68.58 35.48,69.62 35.48,73 CAN2._L
N$9
  Top 0.305: U$2.P$1 C7.2
N$10
  Top 0.305: IC1.12 R24.1
N$11
  Top 0.305: R6.1 13.1,16.28 LED2.A
N$12
  Top 0.305: U$2.P$6 43.11,67.07 42.84,66.8 40.97,66.8 40.71,67.05 C9.2
N$13
  Top 0.305: R7.1 LED3.A
N$14
  Top 0.305: U$2.P$3 45.06,68.84 45.36,69.13 C7.1
N$15
  Top 0.305: U$2.P$2 45.71,67 45.87,66.85 47.29,66.85 47.49,67.05 C11.2
N$16
  Top 0.305: U$2.P$5 43.76,68.77 43.35,69.19 C10.1
N$17
  Top 0.305: U$2.P$4 44.41,69.66 C10.2
N$18
  Top 0.305: U$2.P$16 C12.1 47.19,60.32 47.54,60.68 U$3.2
N$19
  Top 0.305: U$3.1 48.87,63.81 R16.1
N$20
  Bottom 0.305: IC2.6 28.9,69.44 27.66,70.68 CAN1._L
N$21
  Bottom 0.305: IC2.7 30.17,73.07 CAN1._H
N$22
  Top 0.305: IC4.7 28.93,67.61 30.35,69.03 31.97,69.03 33.02,70.07 33.02,73.02 CAN2._H
N$23
  Top 0.305: R11.2 23.83,58.35 U$26.1
N$26  (1 unrouted)
N$27
  Top 0.305: U$2.P$7 42.46,70.07 43.17,70.78 45.13,70.78 45.46,71.11 UART2.P$3
N$28
  Top 0.305: U$2.P$8 41.81,70.14 42.92,71.24 42.92,71.83 42.97,71.88 42.97,72.87 UART2.P$2
N$29  (2 unrouted)
N$30  (2 unrouted)
N$31
  Top 0.305: X6.1 17.69,67.76 R22.2
N$38
  Top 0.305: IC1.11 29.98,32.1 R21.1 29.5,32.58
N$44  (1 unrouted)
N$63
  Top 0.305: U$27.P$5 R10.1
PGEC/RX  (via drill 0.7 pad 0.61)
  Top 0.305: PROG1.1 10.82,16.35 R6.2 | IC1.24 v33.85,25.6
  Bottom 0.305: v33.85,25.6 31.39,25.6 24.48,18.69 14.55,18.69 12.77,16.91 9.01,16.91 PROG1.1
PGED/TX
  Top 0.305: PROG1.2 10.85,18.89 R7.2 12.14,17.6 12.97,17.6 14.24,18.87 24.2,18.87 30.45,25.12 IC1.25
PIC_RA0
  Top 0.305: I/OS2.2 8.38,44.65 9.67,44.65 10.74,43.58 10.74,41.32 23.54,28.52 29.61,28.52 30.2,29.1 IC1.17
PIC_RA1
  Top 0.305: IC1.38 40,18.11 37.66,15.77 34.23,15.77 JP5.1
PIC_RA2
  Top 0.305: IC1.58 48.97,28.62 50.54,27.05 50.54,24.25 52.6,22.2 55.32,22.2 59.94,17.57 59.94,15.29 JP1.1
PIC_RA3
  Top 0.305: IC1.59 49.2,29.1 51.25,27.05 51.25,24.2 52.83,22.63 55.65,22.63 60.4,17.88 61.74,17.88 64.56,15.06 JP1.2
PIC_RA4
  Top 0.305: IC1.60 49.42,29.61 51.86,27.17 51.86,24.28 52.95,23.18 55.8,23.18 60.57,18.41 61.84,18.41 JP2.1
PIC_RA5
  Top 0.305: IC1.61 50.31,30.12 50.72,29.71 50.72,28.98 52.45,27.25 52.45,24.33 52.98,23.8 55.98,23.8 60.75,19.02 62.07,19.02 66.52,14.57 68.22,14.57 JP2.2
PIC_RA9
  Top 0.305: IC1.28 35,22.37 34.23,21.61 29.51,21.61 24.96,17.06 20.32,17.06 JP10.1
PIC_RA10
  Top 0.305: IC1.29 35.5,22.14 33.83,20.47 29.26,20.47 25.19,16.4 22.2,16.4 JP10.2
PIC_RB2
  Top 0.305: I/OS2.8 8.38,29.41 16.1,29.41 19.88,25.62 31.03,25.62 31.52,26.11 IC1.23
PIC_RB3
  Top 0.305: I/OS2.7 8.38,31.95 14.57,31.95 20.42,26.11 30.8,26.11 31.31,26.61 IC1.22
PIC_RB4
  Top 0.305: I/OS2.6 12.9,34.46 19.93,27.43 20.24,27.12 20.82,26.54 30.53,26.54 31.11,27.12 IC1.21
PIC_RB5
  Top 0.305: I/OS2.5 8.4,36.95 11.25,36.95 20.33,27.87 20.59,27.61 21.13,27.07 30.4,27.07 30.93,27.61 IC1.20
PIC_RB6
  Top 0.305: IC1.26 34.01,24.18 33.67,24.51 33.34,24.51 32.63,23.8 29.99,23.8 24.58,18.39 17.8,18.39 14.07,14.65 12.26,14.65 11.32,13.71 11.32,12.92 JP9.1
PIC_RB7
  Top 0.305: IC1.27 34.49,22.65 34.01,22.17 29.23,22.17 25.24,18.18 25.24,18.16 24.79,17.7 18.43,17.7 JP9.2
PIC_RB8
  Top 0.305: JP11.1 23.9,15.54 25.32,15.54 29.51,19.73 36.52,19.73 37.46,20.67 37.46,21.61 37,22.07 IC1.32
PIC_RB9
  Top 0.305: JP11.2 30.02,19.12 37.31,19.12 37.97,19.78 37.97,21.79 37.51,22.25 IC1.33
PIC_RB10
  Top 0.305: IC1.34 37.99,22.42 38.55,21.86 38.55,18.16 37.89,17.5 30.98,17.5 JP12.1
PIC_RB11
  Top 0.305: IC1.35 38.5,22.6 39.03,22.07 39.03,17.85 38.15,16.96 32.99,16.96 JP12.2
PIC_RB12
  Top 0.305: IC1.41 41.5,15.41 JP6.2
PIC_RB13
  Top 0.305: IC1.42 42.01,13.38 JP7.1
PIC_RB14  (1 unrouted)
PIC_RB15
  Top 0.305: IC1.44 43,18.54 46.81,14.73 46.81,13.18 JP8.1
PIC_RD14
  Top 0.305: IC1.47 44.5,17.98 JP8.2
PIC_RE8
  Top 0.305: I/OS2.3 8.43,42.16 8.83,42.16 22.96,28.04 29.87,28.04 30.45,28.62 IC1.18
PIC_RE9
  Top 0.305: I/OS2.4 8.45,39.64 9.5,39.64 21.59,27.55 30.12,27.55 30.68,28.11 IC1.19
PIC_RF2
  Top 0.305: JP4.1 46.91,18.08 46.91,24.43 46.48,24.86 46.48,25.37 46.71,25.6 IC1.52
PIC_RF8
  Top 0.305: JP4.2 52.73,14.8 50.97,14.8 48.81,16.96 48.81,25.83 48.53,26.11 IC1.53
PIC_RF12
  Top 0.305: IC1.40 40.99,16.43 39.26,14.7 38.25,14.7 JP6.1
PIC_RF13
  Top 0.305: IC1.39 40.51,17.8 37.94,15.23 36.24,15.23 JP5.2
PIC_RG2
  Top 0.305: IC1.57 48.76,28.11 49.93,26.94 49.93,24.15 52.39,21.69 55.14,21.69 59.41,17.42 59.41,13.25 JP3.2
PIC_RG3
  Top 0.305: IC1.56 48.53,27.61 49.35,26.79 49.35,23.87 51.96,21.25 54.81,21.25 56.87,19.2 56.87,13.25 JP3.1
PIC_RG9
  Top 0.305: IC1.14 30.45,30.6 30.12,30.93 23.44,30.93 11.45,42.92 11.45,44.88 9.16,47.16 I/OS2.1
PWM1_H
  Top 0.305: IC1.94 37,39.54 34.03,42.52 30.88,42.52 11.15,62.25 11.15,63.52 9.42,65.25 PWM_CON.2
PWM1_L
  Top 0.305: IC1.93 37.51,39.85 34.23,43.12 31.19,43.12 12.06,62.25 12.06,64.05 PWM_CON.1
PWM2_H
  Top 0.305: IC1.99 34.49,39.64 33.09,41.04 29.99,41.04 18.16,52.88 15.62,52.88 PWM_CON.4
PWM2_L
  Top 0.305: IC1.98 35,39.82 32.94,41.88 29.94,41.88 18.31,53.51 16.1,53.51 10.61,59 10.61,60.42 PWM_CON.3
PWM3_H
  Top 0.305: IC1.3 31.34,36.11 26.49,40.97 26.49,42.9 18.03,51.35 11.22,51.35 10.56,52.01 10.56,53.95 9.37,55.14 8.38,55.14 PWM_CON.6
PWM3_L
  Top 0.305: IC1.100 34.01,39.54 33.29,40.25 30.04,40.25 18.77,51.53 18.74,51.53 18.08,52.19 13.76,52.19 PWM_CON.5
PWM4_H
  Top 0.305: PWM_CON.8 17.88,50.01 25.5,42.39 25.5,40.56 30.96,35.1 IC1.5
PWM4_L
  Top 0.305: IC1.4 31.16,35.61 25.98,40.79 25.98,42.54 17.83,50.69 10.18,50.69 PWM_CON.7
UART1_RX
  Top 0.305: IC1.76 45.99,57.96 43.76,60.19 U$2.P$12
UART1_TX
  Top 0.305: IC1.77 45.51,57.63 43.11,60.02 U$2.P$11
UART2_RX
  Top 0.305: IC1.79 44.5,57.02 41.81,59.7 U$2.P$9
UART2_TX
  Top 0.305: IC1.78 45,57.32 42.46,59.86 U$2.P$10
V+  (via drill 0.7 pad 0.61)  (6 unrouted)
  Top 0.305: IC1.2 33.27,36.62 33.55,36.9 33.55,37.74 33.09,38.2 32.24,38.2 C22.1 32.19,39.04 31.9,39.34 v29.84,39.34 | C20.1 40.74,40.23 40.99,39.98 IC1.86 v40.99,37.21 | C19.1 35.61,21.04 35.61,21.51 36.01,21.91 IC1.30 v36.01,24.94 | C23.1 29.69,29.23 30.07,29.61 IC1.16 v33.8,29.61 | R17.2 26.66,54.93 v26.66,52.8 26.87,52.6 33.32,52.6 34.69,51.23 34.69,46.43 | IC1.62 v45.79,30.6 | IC1.46 43.99,24.84 v44.01,24.86 39.98,24.86 39.49,24.38 IC1.37
  Bottom 0.305: v29.84,39.34 29.56,39.34 28.24,40.66 28.24,50.82 26.66,52.39 v26.66,52.8 | v40.99,37.21 40.99,37.05 | v45.79,30.6 45.69,30.6 | v44.01,24.86 44.01,25.01 44.04,25.04 | v36.01,24.94 36.01,24.86 | v33.8,29.61 33.9,29.61
VDD_RADIO  (via drill 0.7 pad 0.61)  (1 unrouted)
  Top 0.406: C4.1 61.39,53.11 61.28,53.21 C3.1 60.1,53.18 59.18,53.18 58.16,52.17 M3.3 | C6.2 55.89,52.37 M3.3 | M3.3 56.99,52.17 57.12,52.04 v57.12,51.28 | M3.3 56.09,50.88 55.67,50.47 R2.2
  Bottom 0.406: v57.12,51.28 57.12,50.85 56.31,50.03 IC3.10
ZB_SPI_MISO  (1 unrouted)
ZB_SPI_MOSI  (1 unrouted)
ZB_SPI_SCK  (1 unrouted)
ZB_WAKE  (1 unrouted)